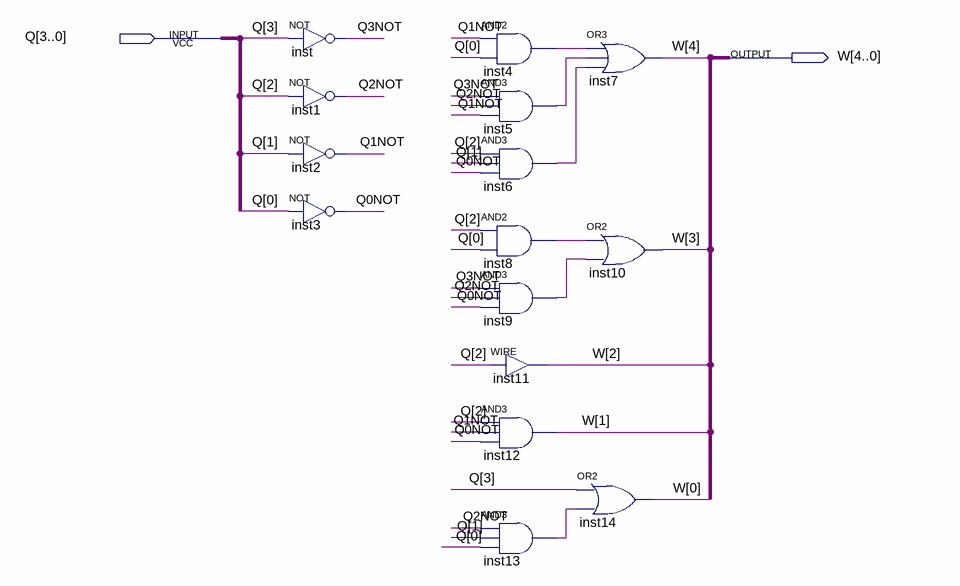
[diagram p0: schematic sheet]
// Quartus schematic DECODE_WRITE.bdf as structural Verilog: 15 symbols, 2 pins
module DECODE_WRITE (
  input  [3:0] Q,
  output [4:0] W
);

  wire inst4_out, inst5_out, inst6_out, inst8_out, inst9_out, inst13_out, Q0NOT, Q1NOT, Q2NOT, Q3NOT;

  not inst (Q3NOT, Q[3]);
  not inst1 (Q2NOT, Q[2]);
  not inst2 (Q1NOT, Q[1]);
  not inst3 (Q0NOT, Q[0]);
  and inst4 (inst4_out, Q1NOT, Q[0]);
  and inst5 (inst5_out, Q3NOT, Q2NOT, Q1NOT);
  and inst6 (inst6_out, Q[2], Q[1], Q0NOT);
  and inst8 (inst8_out, Q[2], Q[0]);
  and inst9 (inst9_out, Q3NOT, Q2NOT, Q0NOT);
  assign W[2] = Q[2];  // WIRE inst11
  and inst12 (W[1], Q[2], Q1NOT, Q0NOT);
  and inst13 (inst13_out, Q2NOT, Q[1], Q[0]);
  or inst7 (W[4], inst4_out, inst5_out, inst6_out);
  or inst10 (W[3], inst8_out, inst9_out);
  or inst14 (W[0], Q[3], inst13_out);
endmodule
